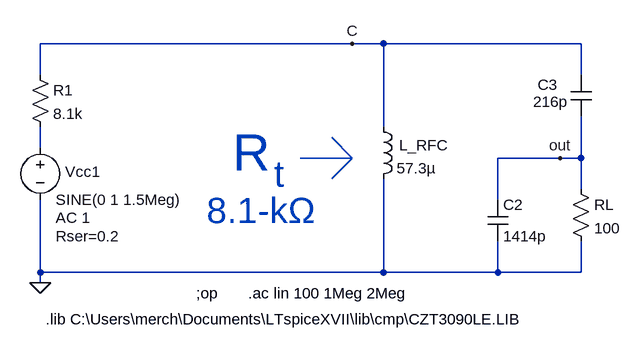
[diagram p0: schematic RF_impedance_Transformer_BW100k.asc]
RF_impedance_Transformer_BW100k.asc, the LTspice schematic file:
Version 4
SHEET 1 2688 680
WIRE 240 -48 -240 -48
WIRE 288 -48 240 -48
WIRE 592 -48 288 -48
WIRE -240 0 -240 -48
WIRE 592 0 592 -48
WIRE 288 80 288 -48
WIRE -240 112 -240 80
WIRE 560 128 464 128
WIRE 592 128 592 64
WIRE 592 128 560 128
WIRE 592 176 592 128
WIRE 464 192 464 128
WIRE -240 304 -240 192
WIRE 288 304 288 160
WIRE 288 304 -240 304
WIRE 464 304 464 256
WIRE 464 304 288 304
WIRE 592 304 592 256
WIRE 592 304 464 304
WIRE -240 320 -240 304
FLAG -240 320 0
FLAG 560 128 out
FLAG 240 -48 C
SYMBOL ind 272 64 R0
WINDOW 0 40 44 Left 2
SYMATTR InstName L_RFC
SYMATTR Value 57.3µ
SYMATTR SpiceLine Ipk=12 Rser=0.0 Cpar=0
SYMBOL res 576 160 R0
SYMATTR InstName RL
SYMATTR Value 100
SYMBOL voltage -240 96 R0
WINDOW 123 24 124 Left 2
WINDOW 39 24 152 Left 2
WINDOW 0 38 53 Left 2
SYMATTR Value2 AC 1
SYMATTR SpiceLine Rser=0.2
SYMATTR InstName Vcc1
SYMATTR Value SINE(0 1 1.5Meg)
SYMBOL res -256 -16 R0
SYMATTR InstName R1
SYMATTR Value 8.1k
SYMBOL cap 448 192 R0
SYMATTR InstName C2
SYMATTR Value 1414p
SYMBOL cap 576 0 R0
WINDOW 0 -51 15 Left 2
WINDOW 3 -58 41 Left 2
SYMATTR InstName C3
SYMATTR Value 216p
TEXT -232 376 Left 2 !.lib C:\\Users\\merch\\Documents\\LTspiceXVII\\lib\\cmp\\CZT3090LE.LIB
TEXT 0 336 Left 2 !;op
TEXT 80 336 Left 2 !.ac lin 100 1Meg 2Meg
TEXT 56 120 Left 6 ;R
TEXT 120 152 Left 5 ;t
TEXT 16 208 Left 5 ;8.1-kΩ
LINE Normal 240 128 160 128
LINE Normal 240 128 208 96
LINE Normal 240 128 240 128 2
LINE Normal 208 160 240 128

The netlist it stands for:
* RF_impedance_Transformer_BW100k.asc
L_RFC C 0 57.3µ Ipk=12 Rser=0.0 Cpar=0
RL out 0 100
Vcc1 N001 0 SINE(0 1 1.5Meg) AC 1 Rser=0.2
R1 C N001 8.1k
C2 out 0 1414p
C3 C out 216p
.lib C:\Users\merch\Documents\LTspiceXVII\lib\cmp\CZT3090LE.LIB
;op
.ac lin 100 1Meg 2Meg
* R
* t
* 8.1-kΩ
.backanno
.end

* Results of the author's LTspice run, read from the files saved beside the schematic
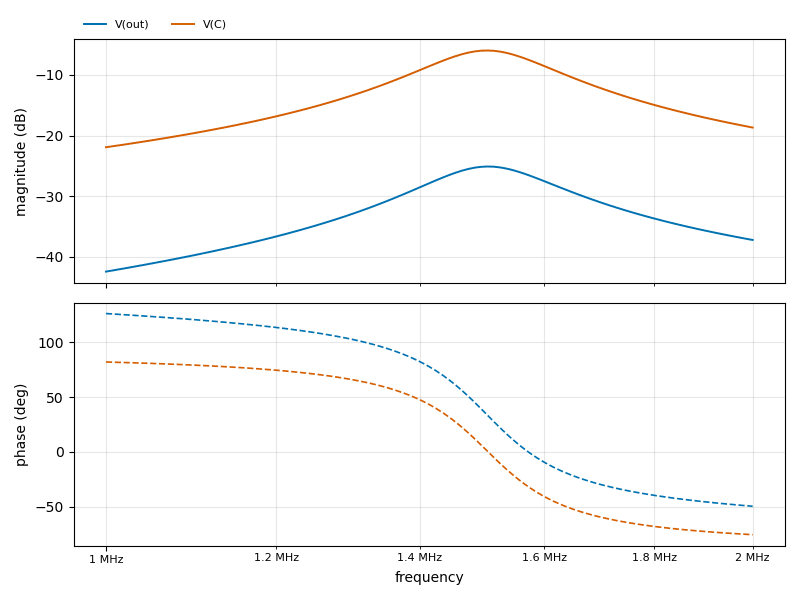
[diagram p1: AC Analysis of RF_impedance_Transformer_BW100k.asc, plotted from the saved traces]
* AC Analysis, 1 run:
*   V(out): -42.41 dB at 1 MHz, -37.20 dB at 2 MHz, peak -25.11 dB at 1.505 MHz, 3 dB below the peak at 1.409 MHz and 1.615 MHz
*   V(C): -21.93 dB at 1 MHz, -18.69 dB at 2 MHz, peak -6.00 dB at 1.505 MHz, 3 dB below the peak at 1.405 MHz and 1.611 MHz